# Altium schematic sheet Sheet_DRV8302_Driver.SchDoc
size 254 x 228 mm
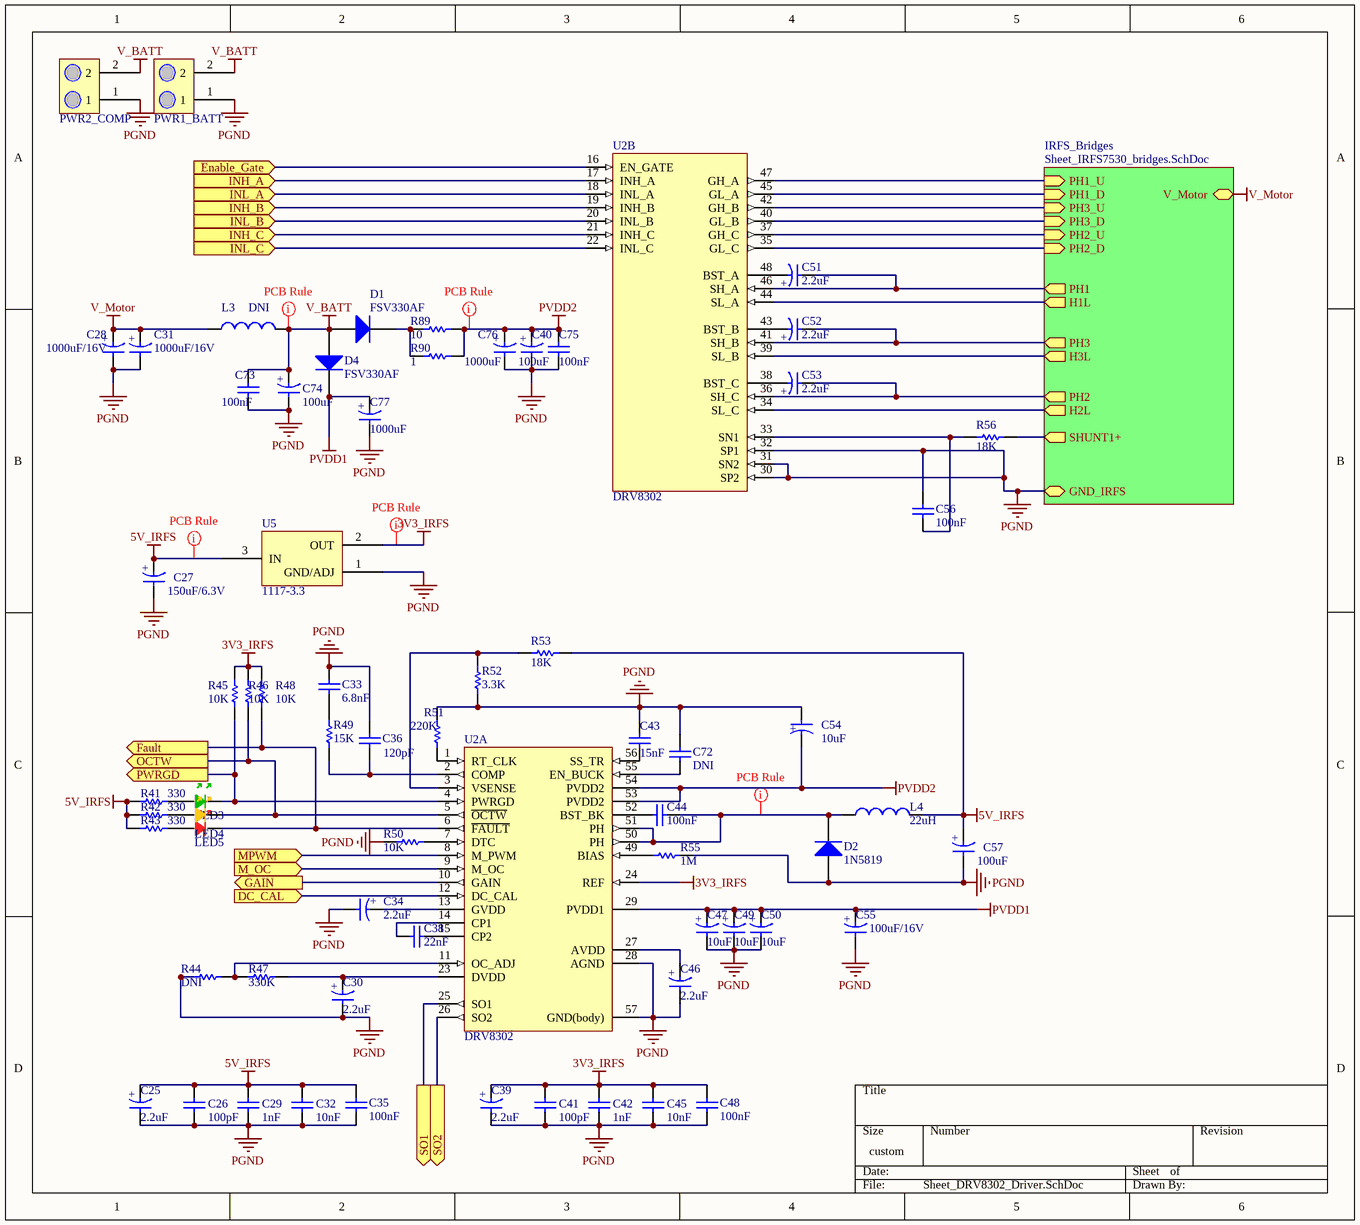
[diagram p0: Sheet_DRV8302_Driver.SchDoc]

## Parts
C25  2.2uF  [1608[0603] - Polar]
C26  100pF  [1608[0603]]
C27  150uF/6.3V  [6032 [2312]]
C28  1000uF/16V  [Large_SMD_Cap]
C29  1nF  [1608[0603]]
C30  2.2uF  [1608[0603] - Polar]
C31  1000uF/16V  [Large_SMD_Cap]
C32  10nF  [1608[0603]]
C33  6.8nF  [1608[0603]]
C34  2.2uF  [1608[0603] - Polar]
C35  100nF  [1608[0603]]
C36  120pF  [1608[0603]]
C38  22nF  [1608[0603]]
C39  2.2uF  [1608[0603] - Polar]
C40  100uF  [6032 [2312]]
C41  100pF  [1608[0603]]
C42  1nF  [1608[0603]]
C43  15nF  [1608[0603]]
C44  100nF  [1608[0603]]
C45  10nF  [1608[0603]]
C46  2.2uF  [1608[0603] - Polar]
C47  10uF  [6032 [2312]]
C48  100nF  [1608[0603]]
C49  10uF  [6032 [2312]]
C50  10uF  [6032 [2312]]
C51  2.2uF  [1608[0603] - Polar]
C52  2.2uF  [1608[0603] - Polar]
C53  2.2uF  [1608[0603] - Polar]
C54  10uF  [6032 [2312]]
C55  100uF/16V  [6032 [2312]]
C56  100nF  [1608[0603]]
C57  100uF  [6032 [2312]]
C72  value DNI  [1608[0603]]  (hidden comment: 1uF)
C73  100nF  [1608[0603]]
C74  100uF  [6032 [2312]]
C75  100nF  [1608[0603]]
C76  1000uF  [Large_SMD_Cap]
C77  1000uF  [Large_SMD_Cap]
D1  FSV330AF  [FSV330AF/FSV340AF]
D2  1N5819  [DIODE-3]
D4  FSV330AF  [FSV330AF/FSV340AF]
L3  DNI  [Toroid]
L4  22uH  [VLC2]
LED3  LEDG  [2012[0805]]  (value not drawn)
LED4  LEDY  [2012[0805]]  (value not drawn)
LED5  LEDR  [2012[0805]]  (value not drawn)
PWR1_BATT  Terminal2  [TERM2]  (value not drawn)
PWR2_COMP  Terminal2  [TERM2]  (value not drawn)
R41  330  [1608[0603]]
R42  330  [1608[0603]]
R43  330  [1608[0603]]
R44  DNI  [1608[0603]]
R45  10K  [1608[0603]]
R46  10K  [1608[0603]]
R47  330K  [1608[0603]]
R48  10K  [1608[0603]]
R49  15K  [1608[0603]]
R50  10K  [1608[0603]]
R51  220K  [1608[0603]]
R52  3.3K  [1608[0603]]
R53  18K  [1608[0603]]
R55  1M  [1608[0603]]
R56  18K  [1608[0603]]
R89  10  [1608[0603]]
R90  1  [2012[0805]]
U2  DRV8302  [DRV8302]  (parts A,B of 2)
U5  1117-3.3  [SOT-223]

## Sub-sheets
IRFS_Bridges = Sheet_IRFS7530_bridges.SchDoc: V_Motor (bidir), GND_IRFS, H1L (out), H2L (out), H3L (out), PH1 (out), PH1_U (in), PH1_D (in), SHUNT1+ (out), PH2_D (in), PH3_D (in), PH2 (out), PH3 (out), PH2_U (in), PH3_U (in)

## Ports
DC_CAL (in), Enable_Gate (in), Fault (out), GAIN (out), INH_A (in), INH_B (in), INH_C (in), INL_A (in), INL_B (in), INL_C (in), M_OC (in), MPWM (in), OCTW (out), PWRGD (out), SO1 (out), SO2 (out)

## Nets
3V3_IRFS: C39.2 C41.2 C42.2 C45.2 C48.1 R45.2 R46.2 R48.2 U2.24(REF) U5.2(OUT)
5V_IRFS: C25.2 C26.2 C27.2 C29.2 C32.2 C35.1 C57.2 L4.2 R41.1 R42.1 R43.1 R53.2 U5.3(IN)
PGND: C25.1 C26.1 C27.1 C28.1 C29.1 C30.1 C31.1 C32.1 C33.1 C34.1 C35.2 C36.1 C39.1 C40.1 C41.1 C42.1 C43.1 C45.1 C46.1 C47.1 C48.2 C49.1 C50.1 C54.1 C55.1 C56.1 C57.1 C72.2 C73.2 C74.1 C75.2 C76.1 C77.1 D2.1(A) PWR1_BATT.1 PWR2_COMP.1 R44.1 R50.1 R51.1 R52.2 R55.2 U2.28(AGND) U2.30(SP2) U2.31(SN2) U2.32(SP1) U2.57(GND(body)) U5.1(GND/ADJ) ; sheet IRFS_Bridges/GND_IRFS
PVDD1: C47.2 C49.2 C50.2 C55.2 C77.2 D4.2(K) U2.29(PVDD1)
PVDD2: C40.2 C54.2 C75.1 C76.2 R89.1 R90.1 U2.53(PVDD2) U2.54(PVDD2)
V_BATT: C73.1 C74.2 D1.1(A) D4.1(A) L3.2 PWR1_BATT.2 PWR2_COMP.2
V_Motor: C28.2 C31.2 L3.1 ; sheet IRFS_Bridges/V_Motor
DC_CAL: U2.12(DC_CAL) ; port DC_CAL
Enable_Gate: U2.16(EN_GATE) ; port Enable_Gate
Fault: LED5.2(K) R48.1 U2.6(~{FAULT}) ; port Fault
GAIN: U2.10(GAIN) ; port GAIN
INH_A: U2.17(INH_A) ; port INH_A
INH_B: U2.19(INH_B) ; port INH_B
INH_C: U2.21(INH_C) ; port INH_C
INL_A: U2.18(INL_A) ; port INL_A
INL_B: U2.20(INL_B) ; port INL_B
INL_C: U2.22(INL_C) ; port INL_C
M_OC: U2.9(M_OC) ; port M_OC
MPWM: U2.8(M_PWM) ; port MPWM
OCTW: LED4.2(K) R46.1 U2.5(~{OCTW}) ; port OCTW
PWRGD: LED3.2(K) R45.1 U2.4(PWRGD) ; port PWRGD
SO1: U2.25(SO1) ; port SO1
SO2: U2.26(SO2) ; port SO2
NetC30_2: C30.2 R47.2 U2.23(DVDD)
NetC33_2: C33.2 R49.2
NetC34_2: C34.2 U2.13(GVDD)
NetC36_2: C36.2 R49.1 U2.2(COMP)
NetC38_1: C38.1 U2.15(CP2)
NetC38_2: C38.2 U2.14(CP1)
NetC43_2: C43.2 U2.56(SS_TR)
NetC44_1: C44.1 U2.52(BST_BK)
NetC44_2: C44.2 D2.2(K) L4.1 U2.50(PH) U2.51(PH)
NetC46_2: C46.2 U2.27(AVDD)
NetC51_1: C51.1 U2.46(SH_A) ; sheet IRFS_Bridges/PH1
NetC51_2: C51.2 U2.48(BST_A)
NetC52_1: C52.1 U2.41(SH_B) ; sheet IRFS_Bridges/PH3
NetC52_2: C52.2 U2.43(BST_B)
NetC53_1: C53.1 U2.36(SH_C) ; sheet IRFS_Bridges/PH2
NetC53_2: C53.2 U2.38(BST_C)
NetC56_2: C56.2 R56.1 U2.33(SN1)
NetC72_1: C72.1 U2.55(EN_BUCK)
NetD1_2: D1.2(K) R89.2 R90.2
NetLED3_1: LED3.1(A) R41.2
NetLED4_1: LED4.1(A) R42.2
NetLED5_1: LED5.1(A) R43.2
NetR44_2: R44.2 R47.1 U2.11(OC_ADJ)
NetR50_2: R50.2 U2.7(DTC)
NetR51_2: R51.2 U2.1(RT_CLK)
NetR52_1: R52.1 R53.1 U2.3(VSENSE)
NetR55_1: R55.1 U2.49(BIAS)
NetR56_2: R56.2 ; sheet IRFS_Bridges/SHUNT1+
NetU2_34: U2.34(SL_C) ; sheet IRFS_Bridges/H2L
NetU2_35: U2.35(GL_C) ; sheet IRFS_Bridges/PH2_D
NetU2_37: U2.37(GH_C) ; sheet IRFS_Bridges/PH2_U
NetU2_39: U2.39(SL_B) ; sheet IRFS_Bridges/H3L
NetU2_40: U2.40(GL_B) ; sheet IRFS_Bridges/PH3_D
NetU2_42: U2.42(GH_B) ; sheet IRFS_Bridges/PH3_U
NetU2_44: U2.44(SL_A) ; sheet IRFS_Bridges/H1L
NetU2_45: U2.45(GL_A) ; sheet IRFS_Bridges/PH1_D
NetU2_47: U2.47(GH_A) ; sheet IRFS_Bridges/PH1_U

## Layout directives
rule Width Constraint [Pref Width = 27.559mil    Min Width = 19.685mil    Max Width = 39.37mil]: 3V3_IRFS, 5V_IRFS, NetC44_2, PVDD2
rule Width Constraint [Pref Width = 27.559mil    Min Width = 19.685mil    Max Width = 196.85mil]: V_BATT

## Notes on the sheet
- (in symbol Cap_E) +

## Library data of the parts
C25 C27 C28 C30 C31 C34 C39 C40 C46 C47 C49-C55 C57 C74 C76 C77 = Cap_E: Capacitor; Supplier 1: Digi-Key
  C25 C30 C34 C39 C46 C51-C53: Value: 2.2uF; Supplier Part Number 1: 478-8647-1-ND
  C27: Value: 150uF/6.3V; Supplier Part Number 1: 478-3481-1-ND
  C28 C31: Value: 1000uF/16V; Supplier Part Number 1: 493-3930-1-ND
  C40 C74: Value: 100uF; Supplier Part Number 1: 478-5258-1-ND
  C47 C49 C50 C54: Value: 10uF; Supplier Part Number 1: 478-1702-1-ND
  C55: Value: 100uF/16V; Supplier Part Number 1: 478-5258-1-ND
  C57: Value: 100uF; Supplier Part Number 1: 478-7995-1-ND
  C76 C77: Value: 1000uF; Supplier Part Number 1: 493-3930-1-ND
C26 C29 C32 C33 C35 C36 C38 C41-C45 C48 C56 C72 C73 C75 = Cap_BP: Capacitor; Supplier 1: Digi-Key
  C26 C41: Value: 100pF; Supplier Part Number 1: 399-1061-1-ND
  C29 C42: Value: 1nF; Supplier Part Number 1: 490-1494-1-ND
  C32 C45: Value: 10nF; Supplier Part Number 1: 311-1085-1-ND
  C33: Value: 6.8nF; Supplier Part Number 1: 445-2667-1-ND
  C35 C44 C48 C56 C75: Value: 100nF; Supplier Part Number 1: 311-1088-1-ND
  C36: Value: 120pF; Supplier Part Number 1: 399-1062-1-ND
  C38: Value: 22nF; Supplier Part Number 1: 399-3476-1-ND
  C43: Value: 15nF; Supplier Part Number 1: 399-10044-1-ND
  C72: Supplier Part Number 1: 478-8658-1-ND
  C73: Value: 100nF; Supplier Part Number 1: 311-1343-1-ND
D1 D2 D4 = Diode: Value: ?; Supplier 1: Digi-Key
  D1 D4: Supplier Part Number 1: FSV330AFCT-ND
  D2: Supplier Part Number 1: 1N5819HW-FDICT-ND
L3 L4 = Inductor: Supplier 1: Digi-Key
  L3: Value: DNI; Supplier Part Number 1: SDR0805-101KLCT-ND
  L4: Value: 22uH; Supplier Part Number 1: SDR0805-220MLCT-ND
LED3 = LED_G: LED; Value: ?; Supplier 1: Digi-Key; Supplier Part Number 1: 475-1410-1-ND
LED4 = LED_Y: LED; Value: ?; Supplier 1: Digi-Key; Supplier Part Number 1: 475-2560-1-ND
LED5 = LED_R: LED; Value: ?; Supplier 1: Digi-Key; Supplier Part Number 1: 475-1278-1-ND
PWR1_BATT PWR2_COMP = Terminal2: Connector; Value: ?
R41-R53 R55 R56 R89 R90 = Res: Supplier 1: Digi-Key
  R41-R43: Value: 330; Supplier Part Number 1: 311-330GRCT-ND
  R44: Value: DNI; Supplier Part Number 1: P10KGCT-ND
  R45 R46 R48 R50: Value: 10K; Supplier Part Number 1: P10KGCT-ND
  R47: Value: 330K; Supplier Part Number 1: P330KGCT-ND
  R49: Value: 15K; Supplier Part Number 1: RMCF0603JT15K0CT-ND
  R51: Value: 220K; Supplier Part Number 1: P220KGCT-ND
  R52: Value: 3.3K; Supplier Part Number 1: RMCF0603JT3K30CT-ND
  R53 R56: Value: 18K; Supplier Part Number 1: RMCF0603JT18K0CT-ND
  R55: Value: 1M; Supplier Part Number 1: P1.00MHCT-ND
  R89: Value: 10; Supplier Part Number 1: 311-10.0CRCT-ND
  R90: Value: 1; Supplier Part Number 1: RMCF0805JT1R00CT-ND
U5 = 1117-3.3V: 3.3V Voltage Regulator; Supplier 1: Digi-Key; Supplier Part Number 1: LM1117IMPX-3.3/NOPBCT-ND
U2 = DRV8302: Supplier 1: Digi-Key; Supplier Part Number 1: 296-29544-6-ND